# Altium schematic sheet Smart WC.SchDoc
size A4
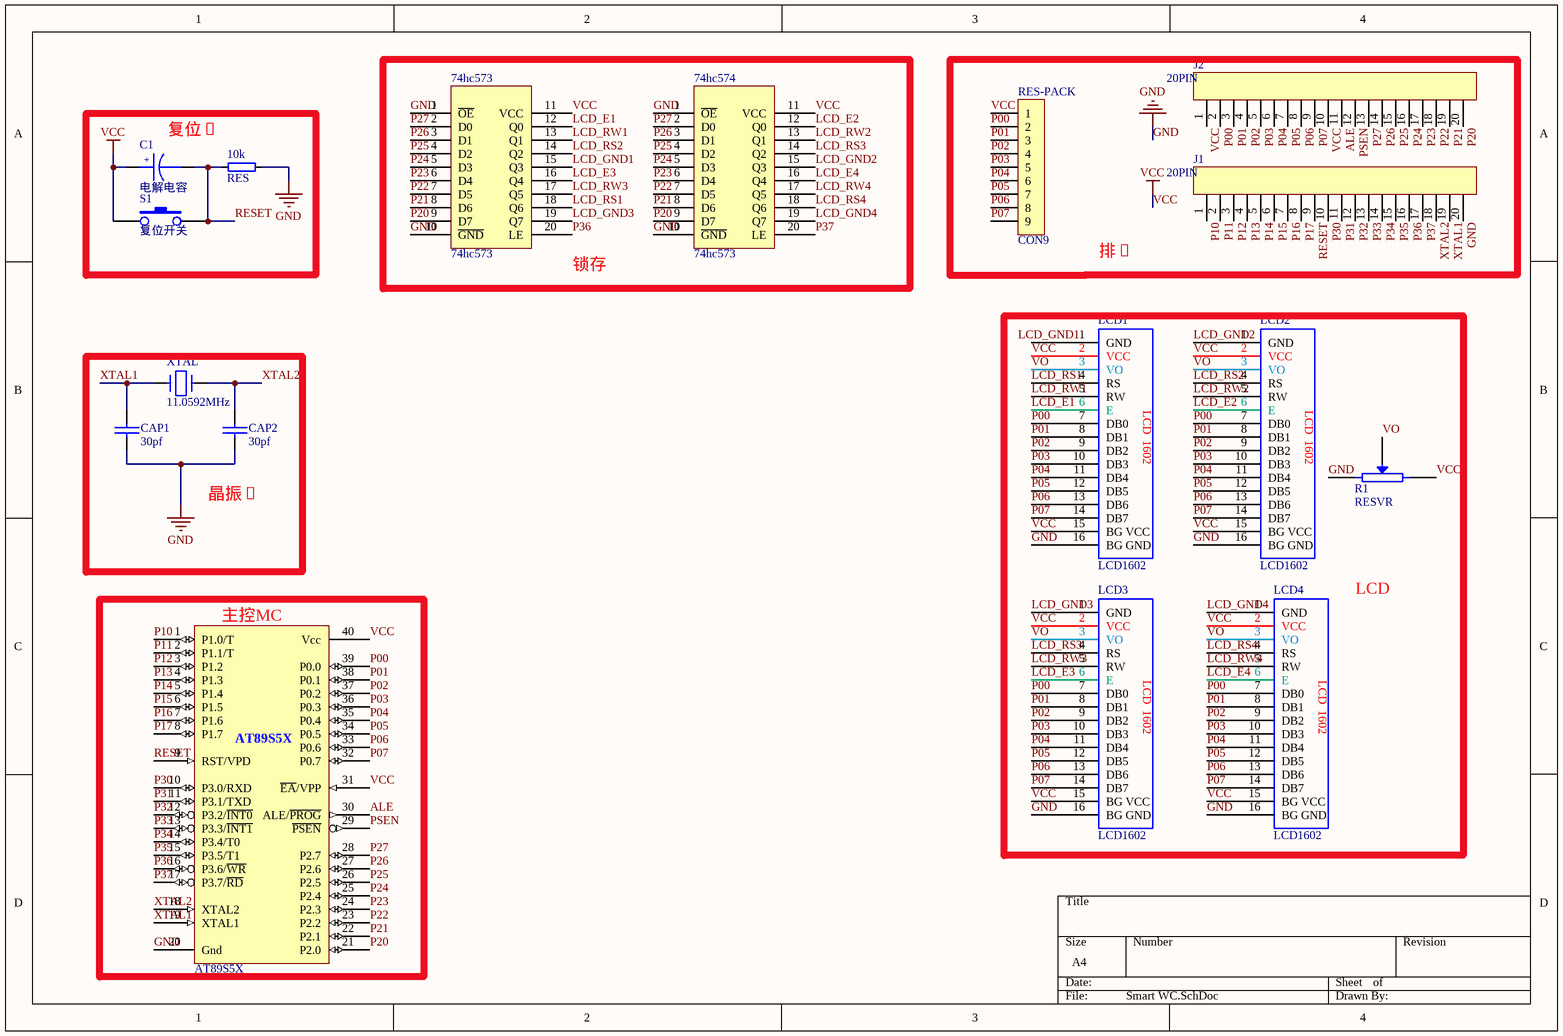
[diagram p0: Smart WC.SchDoc]

## Parts
10k  RES  [AXIAL0.3]
74hc573  74hc573  [DIP20]
74hc574  74hc573  [DIP20]
?  AT89S5X  [LOCK40PIN]
C1  (no value)  [CD4]
CAP1  30pf  [RAD0.3]
CAP2  30pf  [RAD0.3]
J1  20PIN  [SIP20]
J2  20PIN  [SIP20]
LCD1  LCD1602  [SIP16]
LCD2  LCD1602  [SIP16]
LCD3  LCD1602  [SIP16]
LCD4  LCD1602  [SIP16]
R1  RESVR  [VR]
RES-PACK  CON9  [SIP9]
S1  Comment|UNIQUEID: 复位开关  [KeyA]
XTAL  11.0592MHz  [XTAL]

## Blocks framed on the sheet
锁存: 74hc573 74hc574
排�: J1 J2 RES-PACK
复位�: 10k C1 S1
LCD: LCD1-LCD4 R1
晶振�: CAP1 CAP2 XTAL
主控MC: ?

## Nets
GND: 10k.1 74hc573.1(~{OE}) 74hc573.10(~{GND}) 74hc574.1(~{OE}) 74hc574.10(~{GND}) ?.20(Gnd) CAP1.2 CAP2.2 J1.20 LCD1.16(BG_GND) LCD2.16(BG_GND) LCD3.16(BG_GND) LCD4.16(BG_GND) R1.1
VCC: 74hc573.11(VCC) 74hc574.11(VCC) ?.31(~{EA}/VPP) ?.40(Vcc) C1.1 J2.1 J2.10 LCD1.2(VCC) LCD1.15(BG_VCC) LCD2.2(VCC) LCD2.15(BG_VCC) LCD3.2(VCC) LCD3.15(BG_VCC) LCD4.2(VCC) LCD4.15(BG_VCC) R1.2 RES-PACK.1 S1.1
ALE: ?.30(ALE/~{PROG}) J2.11
LCD_E1: 74hc573.12(Q0) LCD1.6(E)
LCD_E2: 74hc574.12(Q0) LCD2.6(E)
LCD_E3: 74hc573.16(Q4) LCD3.6(E)
LCD_E4: 74hc574.16(Q4) LCD4.6(E)
LCD_GND1: 74hc573.15(Q3)
LCD_GND2: 74hc574.15(Q3) LCD2.1(GND)
LCD_GND3: 74hc573.19(Q7) LCD3.1(GND)
LCD_GND4: 74hc574.19(Q7) LCD4.1(GND)
LCD_RS1: 74hc573.18(Q6) LCD1.4(RS)
LCD_RS2: 74hc573.14(Q2) LCD2.4(RS)
LCD_RS3: 74hc574.14(Q2) LCD3.4(RS)
LCD_RS4: 74hc574.18(Q6) LCD4.4(RS)
LCD_RW1: 74hc573.13(Q1) LCD1.5(RW)
LCD_RW2: 74hc574.13(Q1) LCD2.5(RW)
LCD_RW3: 74hc573.17(Q5) LCD3.5(RW)
LCD_RW4: 74hc574.17(Q5) LCD4.5(RW)
P00: ?.39(P0.0) J2.2 LCD1.7(DB0) LCD2.7(DB0) LCD3.7(DB0) LCD4.7(DB0) RES-PACK.2
P01: ?.38(P0.1) J2.3 LCD1.8(DB1) LCD2.8(DB1) LCD3.8(DB1) LCD4.8(DB1) RES-PACK.3
P02: ?.37(P0.2) J2.4 LCD1.9(DB2) LCD2.9(DB2) LCD3.9(DB2) LCD4.9(DB2) RES-PACK.4
P03: ?.36(P0.3) J2.5 LCD1.10(DB3) LCD2.10(DB3) LCD3.10(DB3) LCD4.10(DB3) RES-PACK.5
P04: ?.35(P0.4) J2.6 LCD1.11(DB4) LCD2.11(DB4) LCD3.11(DB4) LCD4.11(DB4) RES-PACK.6
P05: ?.34(P0.5) J2.7 LCD1.12(DB5) LCD2.12(DB5) LCD3.12(DB5) LCD4.12(DB5) RES-PACK.7
P06: ?.33(P0.6) J2.8 LCD1.13(DB6) LCD2.13(DB6) LCD3.13(DB6) LCD4.13(DB6) RES-PACK.8
P07: ?.32(P0.7) J2.9 LCD1.14(DB7) LCD2.14(DB7) LCD3.14(DB7) LCD4.14(DB7) RES-PACK.9
P10: ?.1(P1.0/T) J1.1
P11: ?.2(P1.1/T) J1.2
P12: ?.3(P1.2) J1.3
P13: ?.4(P1.3) J1.4
P14: ?.5(P1.4) J1.5
P15: ?.6(P1.5) J1.6
P16: ?.7(P1.6) J1.7
P17: ?.8(P1.7) J1.8
P20: 74hc573.9(D7) 74hc574.9(D7) ?.21(P2.0) J2.20
P21: 74hc573.8(D6) 74hc574.8(D6) ?.22(P2.1) J2.19
P22: 74hc573.7(D5) 74hc574.7(D5) ?.23(P2.2) J2.18
P23: 74hc573.6(D4) 74hc574.6(D4) ?.24(P2.3) J2.17
P24: 74hc573.5(D3) 74hc574.5(D3) ?.25(P2.4) J2.16
P25: 74hc573.4(D2) 74hc574.4(D2) ?.26(P2.5) J2.15
P26: 74hc573.3(D1) 74hc574.3(D1) ?.27(P2.6) J2.14
P27: 74hc573.2(D0) 74hc574.2(D0) ?.28(P2.7) J2.13
P30: ?.10(P3.0/RXD) J1.10
P31: ?.11(P3.1/TXD) J1.11
P32: ?.12(P3.2/~{INT0}) J1.12
P33: ?.13(P3.3/~{INT1}) J1.13
P34: ?.14(P3.4/T0) J1.14
P35: ?.15(P3.5/T1) J1.15
P36: 74hc573.20(LE) ?.16(P3.6/~{WR}) J1.16
P37: 74hc574.20(LE) ?.17(P3.7/~{RD}) J1.17
PSEN: ?.29(~{PSEN}) J2.12
RESET: 10k.2 ?.9(RST/VPD) C1.2 J1.9 S1.2
VO: LCD1.3(VO) LCD2.3(VO) LCD3.3(VO) LCD4.3(VO) R1.3(W)
XTAL1: ?.19(XTAL1) CAP1.1 J1.19 XTAL.1
XTAL2: ?.18(XTAL2) CAP2.1 J1.18 XTAL.2

Not connected (* = marked no-connect by the designer): LCD1 1(GND)

## Notes on the sheet
- Labels drawn without touching a wire or pin: LCD_GND1
- (in symbol LCD1602) LCD  1602
- (in symbol 电解电容) +

## Library data of the parts
74hc573 74hc574 = Component_1: pin to pad: 11>20 12>19 13>18 14>17 15>16 16>15 17>14 18>13 19>12 20>11
? = AT
C1 = 电解电容: Capacitor; Comment|UNIQUEID: 电解电容
CAP1 CAP2 = CAP
J1 J2 = 20
R1 = RES: Potentiometer
RES-PACK = CON9: Connector
S1 = 微动开关
XTAL = CRY